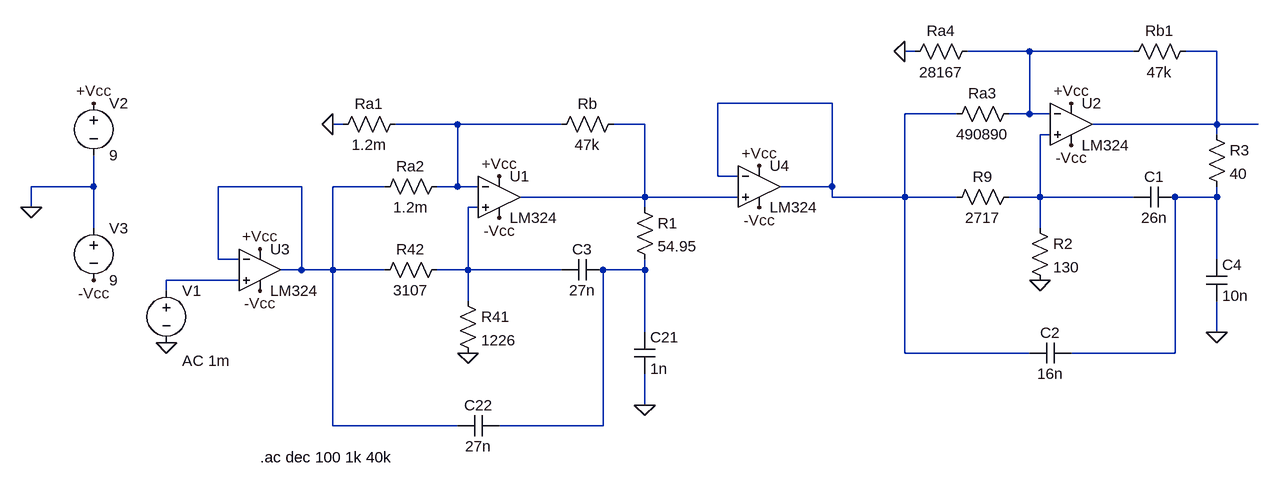
[diagram p0: schematic Sedra_complete_values.asc]
Sedra_complete_values.asc, the LTspice schematic file:
Version 4
SHEET 1 1668 680
WIRE 1072 -224 1056 -224
WIRE 1248 -224 1152 -224
WIRE 1408 -224 1248 -224
WIRE 1536 -224 1488 -224
WIRE 944 -144 768 -144
WIRE 1136 -128 1056 -128
WIRE 1248 -128 1248 -224
WIRE 1248 -128 1216 -128
WIRE 1280 -128 1248 -128
WIRE 192 -112 176 -112
WIRE 368 -112 272 -112
WIRE 528 -112 368 -112
WIRE 656 -112 608 -112
WIRE 1536 -112 1536 -224
WIRE 1536 -112 1344 -112
WIRE 1600 -112 1536 -112
WIRE 1280 -96 1264 -96
WIRE 1536 -96 1536 -112
WIRE 768 -32 768 -144
WIRE 800 -32 768 -32
WIRE -192 -16 -192 -64
WIRE -192 -16 -288 -16
WIRE 128 -16 0 -16
WIRE 256 -16 176 -16
WIRE 368 -16 368 -112
WIRE 368 -16 336 -16
WIRE 400 -16 368 -16
WIRE 944 -16 944 -144
WIRE 944 -16 864 -16
WIRE 656 0 656 -112
WIRE 656 0 464 0
WIRE 800 0 656 0
WIRE 944 0 944 -16
WIRE 1056 0 1056 -128
WIRE 1056 0 944 0
WIRE 1136 0 1056 0
WIRE 1264 0 1264 -96
WIRE 1264 0 1216 0
WIRE 1408 0 1264 0
WIRE 1536 0 1536 -16
WIRE 1536 0 1472 0
WIRE -288 16 -288 -16
WIRE 400 16 384 16
WIRE 656 16 656 0
WIRE -192 48 -192 -16
WIRE 1264 48 1264 0
WIRE 0 96 0 -16
WIRE 32 96 0 96
WIRE 1536 96 1536 0
WIRE 128 112 128 -16
WIRE 128 112 96 112
WIRE 176 112 176 -16
WIRE 176 112 128 112
WIRE 256 112 176 112
WIRE 384 112 384 16
WIRE 384 112 336 112
WIRE 528 112 384 112
WIRE 656 112 656 96
WIRE 656 112 592 112
WIRE 32 128 -80 128
WIRE -80 144 -80 128
WIRE 384 160 384 112
WIRE 656 208 656 112
WIRE 1536 208 1536 160
WIRE 1056 240 1056 0
WIRE 1248 240 1056 240
WIRE 1472 240 1472 0
WIRE 1472 240 1312 240
WIRE 656 320 656 272
WIRE 176 352 176 112
WIRE 368 352 176 352
WIRE 592 352 592 112
WIRE 592 352 432 352
FLAG -80 224 0
FLAG 384 240 0
FLAG 176 -112 0
FLAG 656 320 0
FLAG -288 16 0
FLAG 432 -32 +Vcc
FLAG 432 32 -Vcc
FLAG -192 -144 +Vcc
FLAG -192 128 -Vcc
FLAG 1264 128 0
FLAG 1056 -224 0
FLAG 1536 208 0
FLAG 1312 -144 +Vcc
FLAG 1312 -80 -Vcc
FLAG 832 -48 +Vcc
FLAG 64 80 +Vcc
FLAG 832 16 -Vcc
FLAG 64 144 -Vcc
SYMBOL voltage -80 128 R0
WINDOW 123 24 124 Left 2
WINDOW 39 0 0 Left 0
SYMATTR Value2 AC 1m
SYMATTR InstName V1
SYMATTR Value ""
SYMBOL res 352 96 R90
WINDOW 0 0 56 VBottom 2
WINDOW 3 32 56 VTop 2
SYMATTR InstName R42
SYMATTR Value 3107
SYMBOL res 352 -32 R90
WINDOW 0 0 56 VBottom 2
WINDOW 3 32 56 VTop 2
SYMATTR InstName Ra2
SYMATTR Value 1.2m
SYMBOL sympropio\\LM324 432 -64 R0
SYMATTR InstName U1
SYMBOL res 368 144 R0
SYMATTR InstName R41
SYMATTR Value 1226
SYMBOL cap 592 96 R90
WINDOW 0 0 32 VBottom 2
WINDOW 3 32 32 VTop 2
SYMATTR InstName C3
SYMATTR Value 27n
SYMBOL cap 432 336 R90
WINDOW 0 0 32 VBottom 2
WINDOW 3 32 32 VTop 2
SYMATTR InstName C22
SYMATTR Value 27n
SYMBOL res 288 -128 R90
WINDOW 0 0 56 VBottom 2
WINDOW 3 32 56 VTop 2
SYMATTR InstName Ra1
SYMATTR Value 1.2m
SYMBOL res 624 -128 R90
WINDOW 0 0 56 VBottom 2
WINDOW 3 32 56 VTop 2
SYMATTR InstName Rb
SYMATTR Value 47k
SYMBOL cap 640 208 R0
SYMATTR InstName C21
SYMATTR Value 1n
SYMBOL voltage -192 -160 R0
WINDOW 123 0 0 Left 0
WINDOW 39 0 0 Left 0
SYMATTR InstName V2
SYMATTR Value 9
SYMBOL voltage -192 32 R0
WINDOW 123 0 0 Left 0
WINDOW 39 0 0 Left 0
SYMATTR InstName V3
SYMATTR Value 9
SYMBOL res 1232 -16 R90
WINDOW 0 0 56 VBottom 2
WINDOW 3 32 56 VTop 2
SYMATTR InstName R9
SYMATTR Value 2717
SYMBOL res 1232 -144 R90
WINDOW 0 0 56 VBottom 2
WINDOW 3 32 56 VTop 2
SYMATTR InstName Ra3
SYMATTR Value 490890
SYMBOL sympropio\\LM324 1312 -176 R0
SYMATTR InstName U2
SYMBOL res 1248 32 R0
SYMATTR InstName R2
SYMATTR Value 130
SYMBOL cap 1472 -16 R90
WINDOW 0 0 32 VBottom 2
WINDOW 3 32 32 VTop 2
SYMATTR InstName C1
SYMATTR Value 26n
SYMBOL cap 1312 224 R90
WINDOW 0 0 32 VBottom 2
WINDOW 3 32 32 VTop 2
SYMATTR InstName C2
SYMATTR Value 16n
SYMBOL res 1168 -240 R90
WINDOW 0 0 56 VBottom 2
WINDOW 3 32 56 VTop 2
SYMATTR InstName Ra4
SYMATTR Value 28167
SYMBOL res 1504 -240 R90
WINDOW 0 0 56 VBottom 2
WINDOW 3 32 56 VTop 2
SYMATTR InstName Rb1
SYMATTR Value 47k
SYMBOL cap 1520 96 R0
SYMATTR InstName C4
SYMATTR Value 10n
SYMBOL res 640 0 R0
SYMATTR InstName R1
SYMATTR Value 54.95
SYMBOL res 1520 -112 R0
SYMATTR InstName R3
SYMATTR Value 40
SYMBOL sympropio\\LM324 64 48 R0
SYMATTR InstName U3
SYMBOL sympropio\\LM324 832 -80 R0
SYMATTR InstName U4
TEXT 64 400 Left 2 !.ac dec 100 1k 40k

The netlist it stands for:
* Sedra_complete_values.asc
V1 N011 0 AC 1m
R42 N009 N007 3107
Ra2 N004 N007 1.2m
* U1: LM324 (symbol sympropio\LM324 not available, pins judged from their places): In+=N009 In-=N004 V+=+Vcc V-=-Vcc OUT=N005
R41 N009 0 1226
C3 N010 N009 27n
C22 N010 N007 27n
Ra1 N004 0 1.2m
Rb N005 N004 47k
C21 N010 0 1n
V2 +Vcc 0 9
V3 0 -Vcc 9
R9 N006 N003 2717
Ra3 N001 N003 490890
* U2: LM324 (symbol sympropio\LM324 not available, pins judged from their places): In+=N006 In-=N001 V+=+Vcc V-=-Vcc OUT=N002
R2 N006 0 130
C1 N008 N006 26n
C2 N008 N003 16n
Ra4 N001 0 28167
Rb1 N002 N001 47k
C4 N008 0 10n
R1 N005 N010 54.95
R3 N002 N008 40
* U3: LM324 (symbol sympropio\LM324 not available, pins judged from their places): In+=N011 In-=N007 V+=+Vcc V-=-Vcc OUT=N007
* U4: LM324 (symbol sympropio\LM324 not available, pins judged from their places): In+=N005 In-=N003 V+=+Vcc V-=-Vcc OUT=N003
.ac dec 100 1k 40k
.backanno
.end